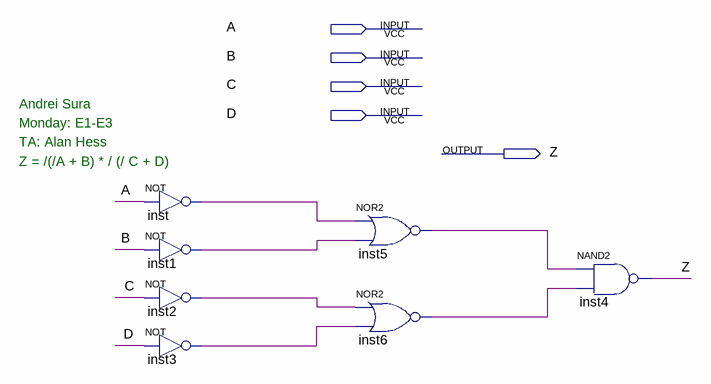
[diagram p0: schematic sheet]
// Quartus schematic lab1_pre_1.bdf as structural Verilog: 7 symbols, 5 pins
module lab1_pre_1 (
  input  A,
  input  B,
  input  C,
  input  D,
  output Z
);

  wire inst1_out, inst2_out, inst3_out, inst5_out, inst6_out, inst_out;

  not inst (inst_out, A);
  not inst1 (inst1_out, B);
  not inst2 (inst2_out, C);
  not inst3 (inst3_out, D);
  nor inst5 (inst5_out, inst_out, inst1_out);
  nor inst6 (inst6_out, inst2_out, inst3_out);
  nand inst4 (Z, inst5_out, inst6_out);

  // Notes on the sheet:
  //   Andrei Sura
  //   Monday: E1-E3
  //   TA: Alan Hess
  //   Z = /(/A + B) * / (/ C + D)
endmodule
